# Altium project DAB_Template4Students.PrjPcb
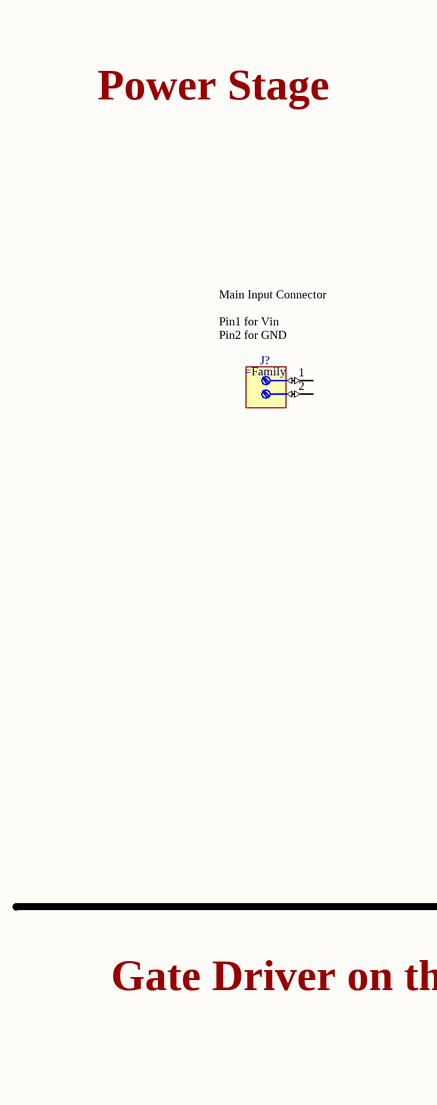
[diagram p0: DAB_Schematic.SchDoc, top left]
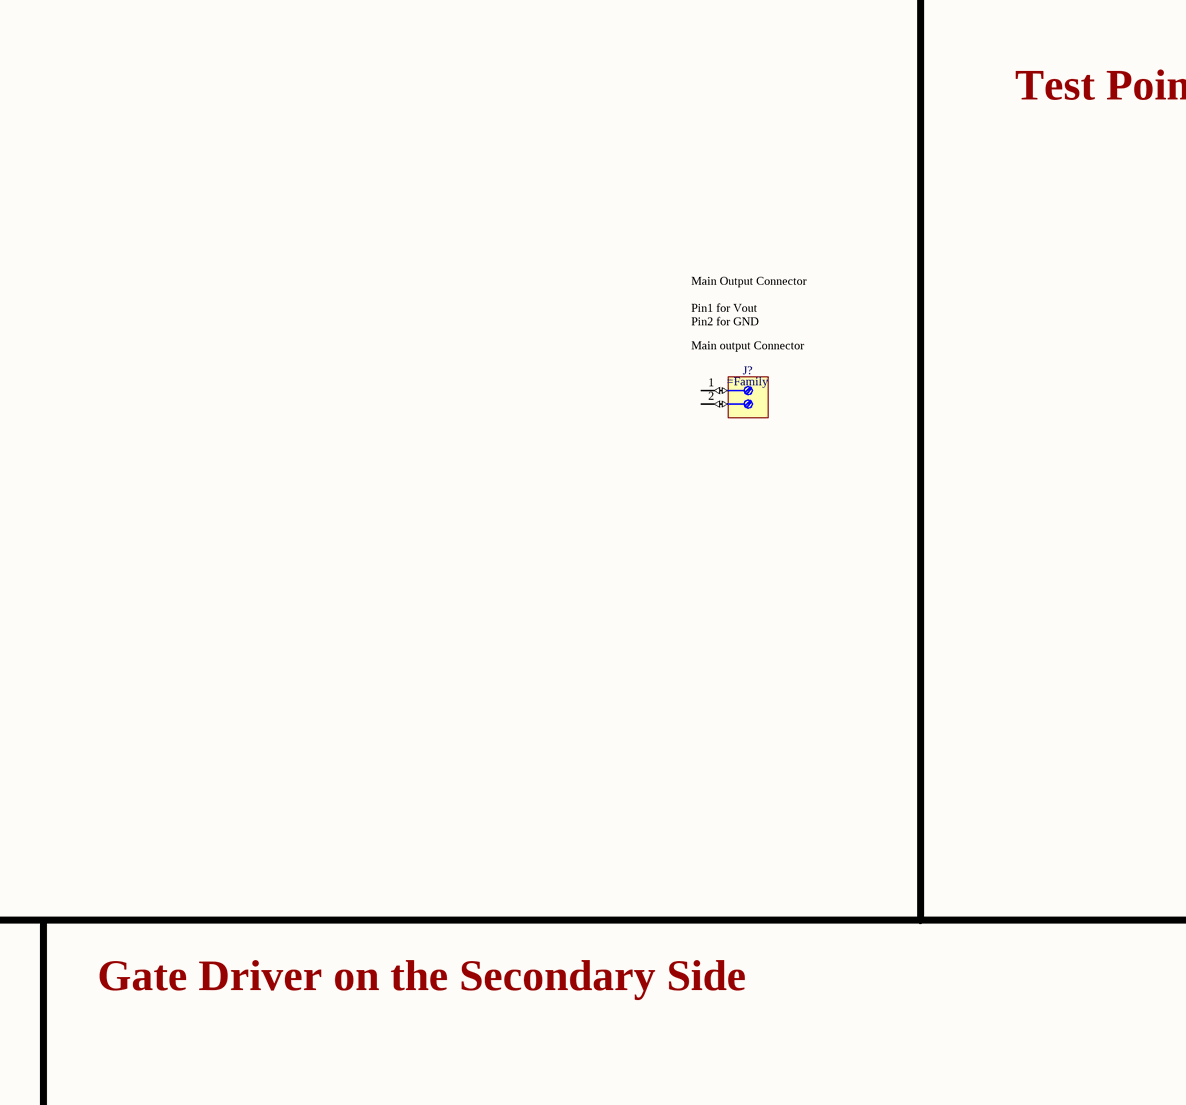
[diagram p1: DAB_Schematic.SchDoc, top middle]
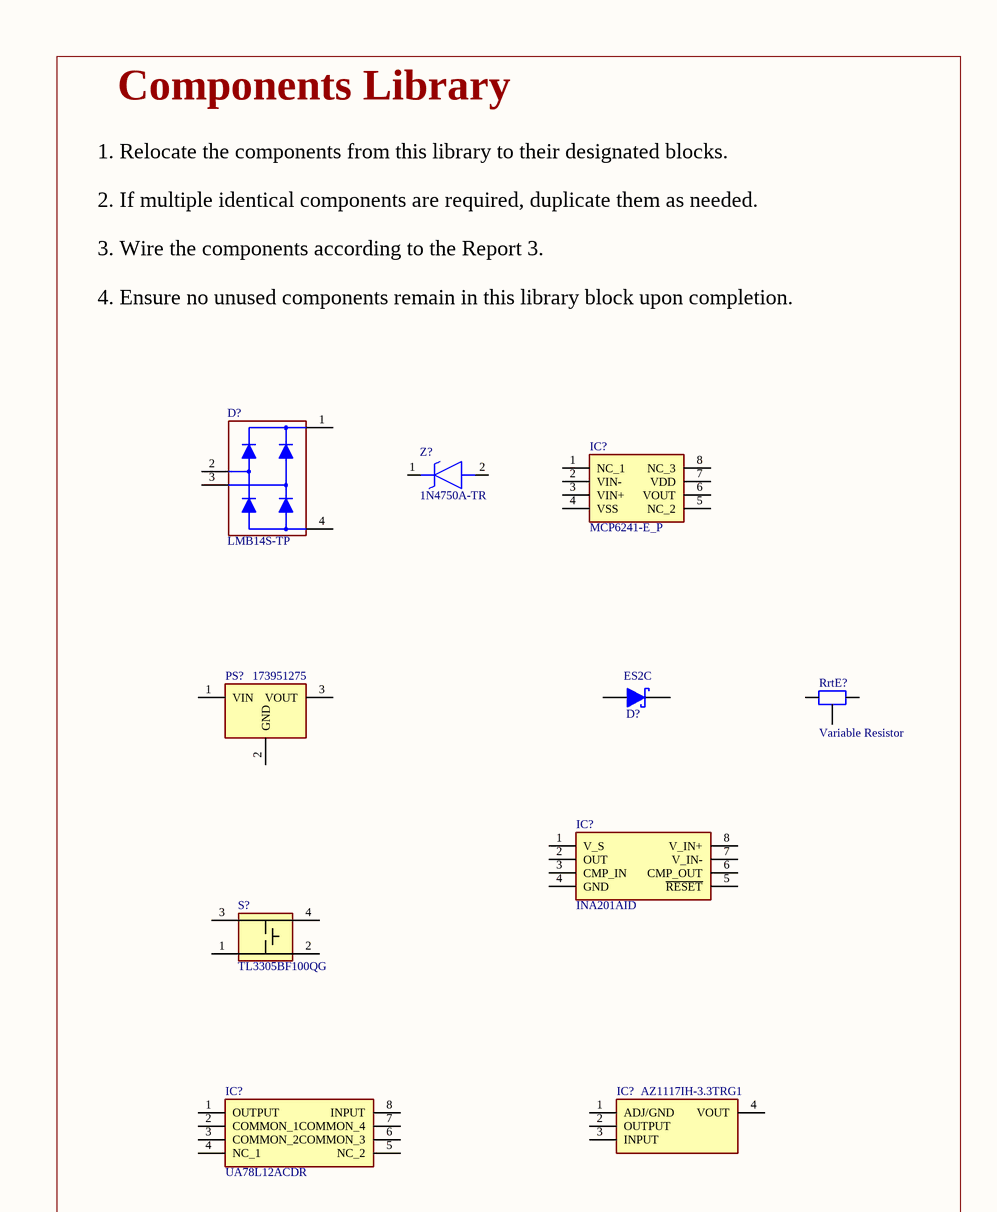
[diagram p2: DAB_Schematic.SchDoc, top right]
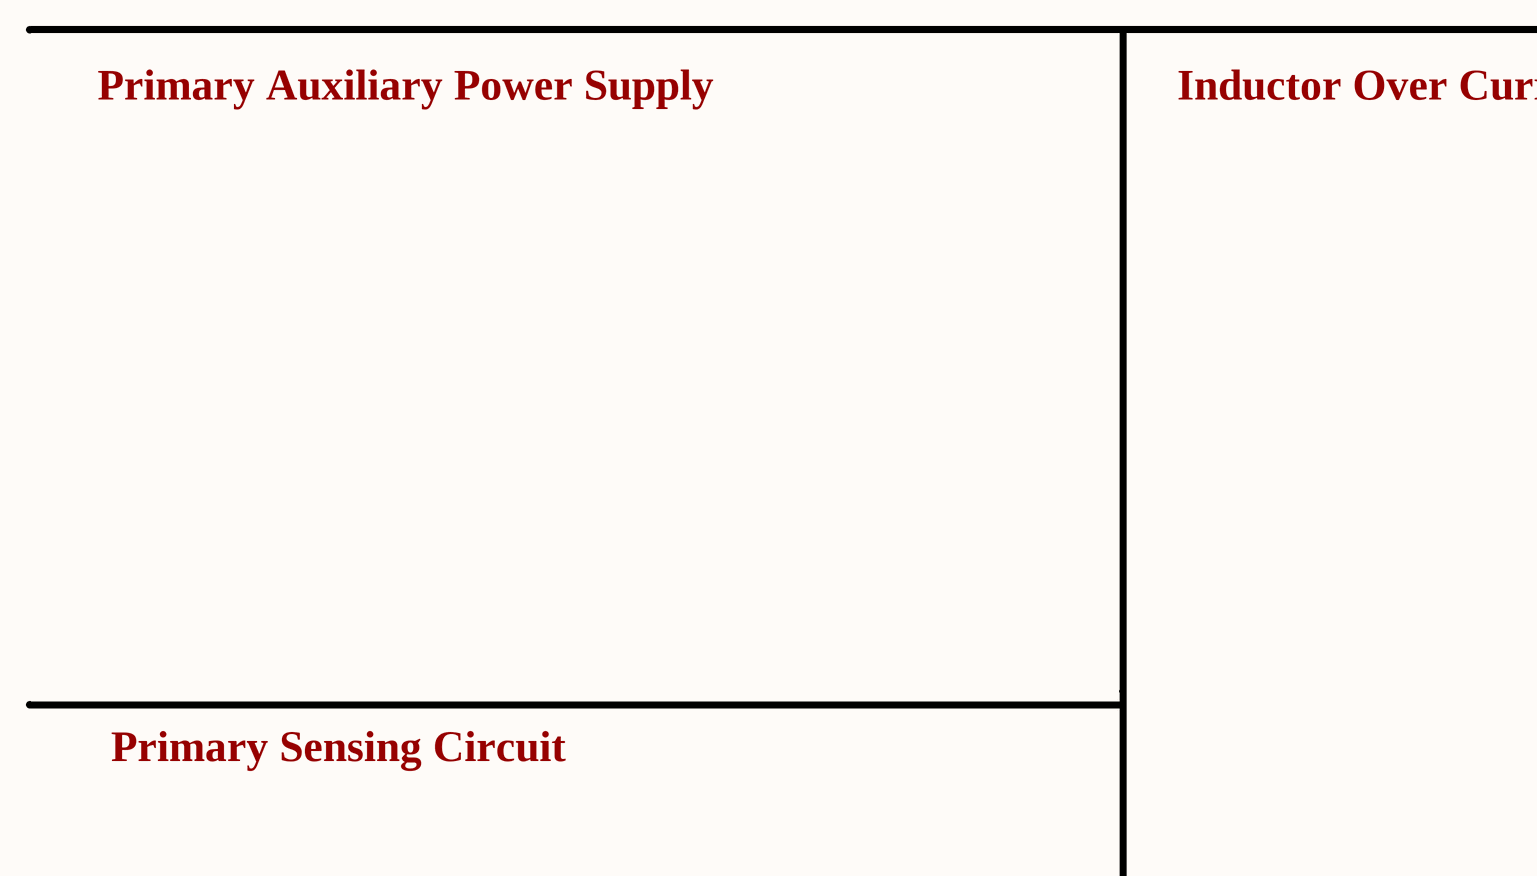
[diagram p3: DAB_Schematic.SchDoc, bottom left]
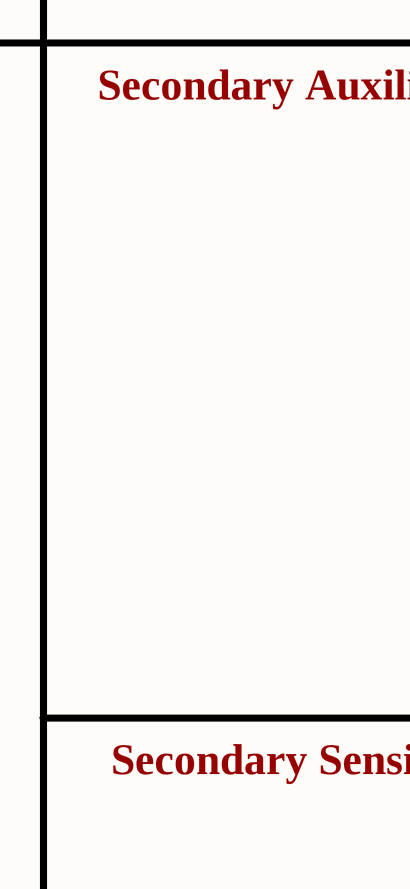
[diagram p4: DAB_Schematic.SchDoc, bottom middle]
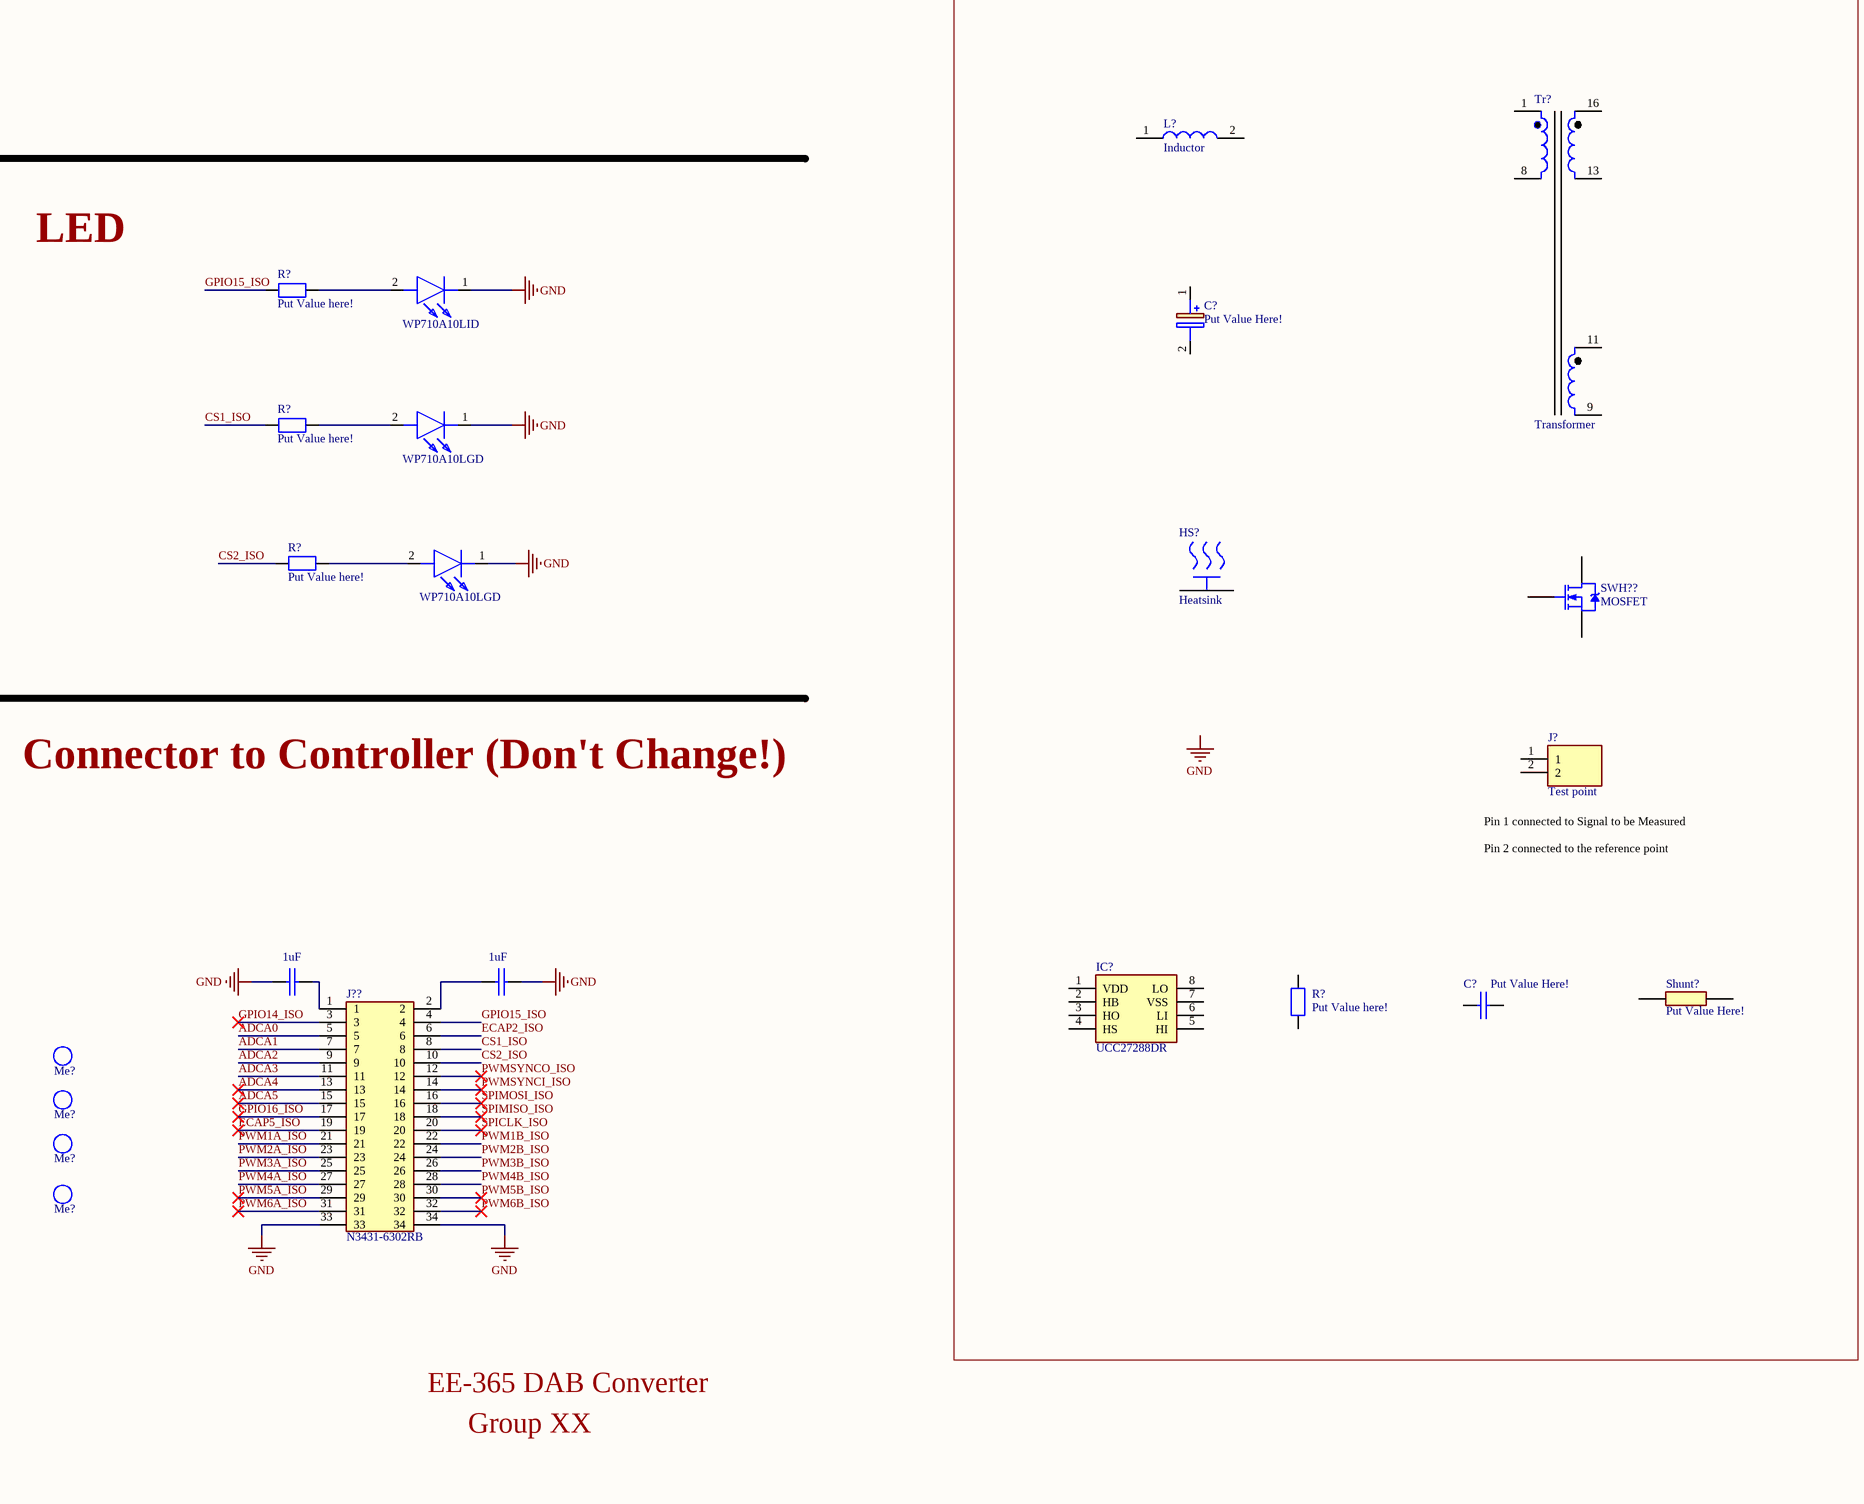
[diagram p5: DAB_Schematic.SchDoc, bottom right]
1 sheet, 35 parts. Net scope: global (net labels, ports and power ports of the same name join across sheets).
Board file: DAB_PCB.PcbDoc

## Sheet DAB_Schematic.SchDoc
size A1; SheetNumber: 1; SheetTotal: 1

### Parts
(Parts that share a designator on the sheet are numbered #1, #2 ... from top to bottom, then left to right.)
C?#1  Put Value Here!  [CAPPRD750W80D1625H3750]
C?#2  1uF  [SM/1206]
C?#3  1uF  [SM/1206]
C?#4  Put Value Here!  [SM/1206]
D?#1  LMB14S-TP  [LMB14STP]
D?#2  ES2C  [DIOM5436X244N]
HS?  Heatsink  [Heatsink FA-T220]
IC?#1  MCP6241-E_P  [DIP781W56P254L950H533Q8N]
IC?#2  INA201AID  [SOIC127P600X175-8N]
IC?#3  UA78L12ACDR  [SOIC127P600X175-8N]
IC?#4  AZ1117IH-3.3TRG1  [SOT230P700X180-4N]
IC?#5  UCC27288DR  [SOIC127P600X175-8N]
J?#1  (no value)  [PHOENIX  1755736]
J?#2  (no value)  [PHOENIX  1755736]
J?#3  Test point  [HDRV2W64P0X508_1X2_1016X254X838P]
J??  N3431-6302RB  [3M_N3431-6302RB]
L?  Inductor
LED?#1  WP710A10LID  [WP710A10LID]
LED?#2  WP710A10LGD  [WP710A10LGD]
LED?#3  WP710A10LGD  [WP710A10LGD]
Me?#1  M3-Hole  [M3]  (value not drawn)
Me?#2  M3-Hole  [M3]  (value not drawn)
Me?#3  M3-Hole  [M3]  (value not drawn)
Me?#4  M3-Hole  [M3]  (value not drawn)
PS?  173951275  [173951275]
R?#1  Put Value here!  [SM/1206]
R?#2  Put Value here!  [SM/1206]
R?#3  Put Value here!  [SM/1206]
R?#4  Put Value here!  [SM/1206]
RrtE?  Variable Resistor  [TRIMMER CT-6EP]
S?  TL3305BF100QG  [TL3305BF160QG]
Shunt?  Put Value Here!  [CSNL2512FT5L00]
SWH??  MOSFET  [TO-220AB]
Tr?  Transformer  [ETD39]
Z?  1N4750A-TR  [DIOAD1310W86L370D235]

### Blocks framed on the sheet
Components Library: C?#1 C?#4 D?#1 D?#2 HS? IC?#1-IC?#5 J?#3 L? PS? R?#4 RrtE? S? Shunt? SWH?? Tr? Z?

### Nets
GND: C?#2.1 C?#3.2 J??.33 J??.34 LED?#1.1(K) LED?#2.1(K) LED?#3.1(K)
ADCA0: J??.5
ADCA1: J??.7
ADCA2: J??.9
ADCA3: J??.11
ADCA4: J??.13
ADCA5: J??.15
CS1_ISO: J??.8 R?#2.2
CS2_ISO: J??.10 R?#3.2
ECAP2_ISO: J??.6
ECAP5_ISO: J??.19
GPIO14_ISO: J??.3
GPIO15_ISO: J??.4 R?#1.2
GPIO16_ISO: J??.17
PWM1A_ISO: J??.21
PWM1B_ISO: J??.22
PWM2A_ISO: J??.23
PWM2B_ISO: J??.24
PWM3A_ISO: J??.25
PWM3B_ISO: J??.26
PWM4A_ISO: J??.27
PWM4B_ISO: J??.28
PWM5A_ISO: J??.29
PWM5B_ISO: J??.30
PWM6A_ISO: J??.31
PWM6B_ISO: J??.32
PWMSYNCI_ISO: J??.14
PWMSYNCO_ISO: J??.12
SPICLK_ISO: J??.20
SPIMISO_ISO: J??.18
SPIMOSI_ISO: J??.16
NetC?#2_2: C?#2.2 J??.1
NetC?#3_1: C?#3.1 J??.2
NetLED?#1_2: LED?#1.2(A) R?#1.1
NetLED?#2_2: LED?#2.2(A) R?#2.1
NetLED?#3_2: LED?#3.2(A) R?#3.1

Not connected (* = marked no-connect by the designer): C?#1 1(+) 2(-); C?#4 1 2; D?#1 1(A) 2(AC_1) 3(AC_2) 4(K); D?#2 1(K) 2(A); HS? 1(MNT_1) 2; IC?#1 1(NC_1) 2(VIN-) 3(VIN+) 4(VSS) 5(NC_2) 6(VOUT) 7(VDD) 8(NC_3); IC?#2 1(V_S) 2(OUT) 3(CMP_IN) 4(GND) 5(~{RESET}) 6(CMP_OUT) 7(V_IN-) 8(V_IN+); IC?#3 1(OUTPUT) 2(COMMON_1) 3(COMMON_2) 4(NC_1) 5(NC_2) 6(COMMON_3) 7(COMMON_4) 8(INPUT); IC?#4 1(ADJ/GND) 2(OUTPUT) 3(INPUT) 4(VOUT); IC?#5 1(VDD) 2(HB) 3(HO) 4(HS) 5(HI) 6(LI) 7(VSS) 8(LO); J?#1 1 2; J?#2 1 2; J?#3 1 2; L? 1 2; PS? 1(VIN) 2(GND) 3(VOUT); R?#4 1 2; RrtE? 1 2 3; S? 1 2 3 4; Shunt? 1 2; SWH?? 1(G) 2(D) 3(S); Tr? 1 8 9 11 13 16; Z? 1(K) 2(A)

### Notes on the sheet
- Power Stage
- Test Points
- Main Output Connector
  Pin1 for Vout
  Pin2 for GND
- (near J?#1) Main Input Connector
  Pin1 for Vin
  Pin2 for GND
- (near J?#2) Main output Connector
- 1. Relocate the components from this library to their designated blocks.
  2. If multiple identical components are required, duplicate them as needed.
  3. Wire the components according to the Report 3.
  4. Ensure no unused components remain in this library block upon completion.
- Gate Driver on the Primary Side
- Gate Driver on the Secondary Side
- Primary Auxiliary Power Supply
- Inductor Over Current Detection Circuit
- Secondary Auxiliary Power Supply
- LED
- Connector to Controller (Don't Change!)
- (near J?#3) Pin 1 connected to Signal to be Measured
  Pin 2 connected to the reference point
- Primary Sensing Circuit
- Secondary Sensing Circuit
- EE-365 DAB Converter
- Group XX
- Labels drawn without touching a wire or pin: GND

### Library data of the parts
C?#1 = UHW2A681MHD: Capacitor; Manufacturer_Name: Nichicon; Datasheet Link: https://www.digikey.ph/en/products/detail/nichicon/UHW2A681MHD/5818028?msockid=39f1ec84d77b6f4428b7f904d6676eed; Height: 37.5mm; Manufacturer_Part_Number: UHW2A681MHD; Mouser Part Number: 647-UHW2A681MHD; Mouser Price/Stock: https://www.mouser.co.uk/ProductDetail/Nichicon/UHW2A681MHD/?qs=KdTYp8tcPgmYzat6Tz8y0A%3D%3D
C?#2-C?#4 = Capacitor (SMD): Capacitor (non polarized)
D?#1 = LMB14S-TP: full-bridge rectifier; Manufacturer_Name: MCC; Datasheet Link: https://www.mccsemi.com/pdf/Products/LMB12S-LMB110S(LMBS-1).pdf; Height: 1.71mm; Manufacturer_Part_Number: LMB14S-TP; Mouser Part Number: 833-LMB14S-TP; Mouser Price/Stock: https://www.mouser.co.uk/ProductDetail/Micro-Commercial-Components-MCC/LMB14S-TP?qs=P1JMDcb91o681gFxLNJ1UQ%3D%3D; Arrow Part Number: LMB14S-TP; Arrow Price/Stock: https://www.arrow.com/en/products/lmb14s-tp/micro-commercial-components
D?#2 = Schottky Diode
HS? = Heatsink: HEATSINK TO-218,TO-220,TO-247
IC?#1 = MCP6241-E_P: Integrated Circuit - Op Amp; Manufacturer_Name: Microchip; Manufacturer_Part_Number: MCP6241-E/P; Datasheet Link: http://ww1.microchip.com/downloads/en/DeviceDoc/21882d.pdf; Height: 5.334mm; Mouser Part Number: 579-MCP6241-E/P; Mouser Price/Stock: https://www.mouser.co.uk/ProductDetail/Microchip-Technology/MCP6241-E-P?qs=g6BBfX6YTkkJAE8LlpYY9A%3D%3D; Arrow Part Number: MCP6241-E/P; Arrow Price/Stock: https://www.arrow.com/en/products/mcp6241-ep/microchip-technology?utm_currency=USD&region=nac
IC?#2 = INA201AID: Integrated Circuit; Manufacturer_Name: Texas Instruments; Datasheet Link: http://www.ti.com/lit/gpn/INA201; Height: 1.75mm; Manufacturer_Part_Number: INA201AID; Mouser Part Number: 595-INA201AID; Mouser Price/Stock: https://www.mouser.co.uk/ProductDetail/Texas-Instruments/INA201AID?qs=wkx8pu8tL7JUWgtgkwU%252B9A%3D%3D; Arrow Part Number: INA201AID; Arrow Price/Stock: https://www.arrow.com/en/products/ina201aid/texas-instruments?utm_currency=USD&region=nac
IC?#3 = UA78L12ACDR: Integrated Circuit; Manufacturer_Name: Texas Instruments; Datasheet Link: http://www.ti.com/lit/gpn/ua78l; Height: 1.75mm; Manufacturer_Part_Number: UA78L12ACDR; Mouser Part Number: 595-UA78L12ACDR; Mouser Price/Stock: https://www.mouser.co.uk/ProductDetail/Texas-Instruments/UA78L12ACDR?qs=0O%2FZFlpUpJW5pw3BJ01ZLg%3D%3D; Arrow Part Number: UA78L12ACDR; Arrow Price/Stock: https://www.arrow.com/en/products/ua78l12acdr/texas-instruments?region=nac
IC?#4 = AZ1117IH-3.3TRG1: Integrated Circuit; Manufacturer_Name: Diodes Incorporated; Datasheet Link: https://www.diodes.com//assets/Datasheets/AZ1117I.pdf; Height: 1.8mm; Manufacturer_Part_Number: AZ1117IH-3.3TRG1; Mouser Part Number: 621-AZ1117IH-3.3TRG1; Mouser Price/Stock: https://www.mouser.co.uk/ProductDetail/Diodes-Incorporated/AZ1117IH-3.3TRG1?qs=cpo3%2FpBou2jnS4SxLgAVoA%3D%3D; Arrow Part Number: AZ1117IH-3.3TRG1; Arrow Price/Stock: https://www.arrow.com/en/products/az1117ih-3.3trg1/diodes-incorporated?utm_currency=USD&region=europe
IC?#5 = UCC27288DR: Integrated Circuit; Manufacturer_Name: Texas Instruments; Datasheet Link: https://www.arrow.com/en/products/ucc27288dr/texas-instruments; Height: 1.75mm; Manufacturer_Part_Number: UCC27288DR; Mouser Part Number: 595-UCC27288DR; Mouser Price/Stock: https://www.mouser.co.uk/ProductDetail/Texas-Instruments/UCC27288DR?qs=zW32dvEIR3s81MTqTT5v9Q%3D%3D; Arrow Part Number: UCC27288DR; Arrow Price/Stock: https://www.arrow.com/en/products/ucc27288dr/texas-instruments?utm_currency=USD&region=europe
J?#1 J?#2 = Phoenix-1755736: Connector 2 pos
J?#3 = Test point: Manufacturer_Name: SAMTEC; Manufacturer_Part_Number: TSW-202-07-T-S; Datasheet Link: http://suddendocs.samtec.com/catalog_english/tsw_th.pdf; Height: 8.38mm; Mouser Part Number: 200-TSW20207TS; Mouser Price/Stock: https://www.mouser.co.uk/ProductDetail/Samtec/TSW-202-07-T-S?qs=rU5fayqh%252BE1T8HlkVOHZPg%3D%3D; Arrow Part Number: TSW-202-07-T-S; Arrow Price/Stock: https://www.arrow.com/en/products/tsw-202-07-t-s/samtec?utm_currency=USD&region=europe
J?? = N3431-6302RB: Connector; Manufacturer_Name: Hirose; Manufacturer_Part_Number: HIF3FC-34PA-2.54DS(71); Datasheet Link: http://uk.rs-online.com/web/p/products/8961111; Height: 8.5mm; Mouser Part Number: 798-HIF3FC34PA254DS1; Mouser Price/Stock: https://www.mouser.co.uk/ProductDetail/Hirose-Connector/HIF3FC-34PA-2.54DS71?qs=eDUdFcBPps12jUkdM6VM2w%3D%3D
L? = Inductor: Manufacturer_Name: TDK; Manufacturer_Part_Number: MLZ2012N100LT000; Datasheet Link: https://product.tdk.com/system/files/dam/doc/product/inductor/inductor/smd/catalog/inductor_commercial_decoupling_mlz2012_en.pdf; Height: 1.05mm; Mouser Part Number: 810-MLZ2012N100LT000; Mouser Price/Stock: https://www.mouser.co.uk/ProductDetail/TDK/MLZ2012N100LT000?qs=%2FPzWLGNeQ%252BhBF9df2MjAZQ%3D%3D; Arrow Part Number: MLZ2012N100LT000; Arrow Price/Stock: https://www.arrow.com/en/products/mlz2012n100lt000/tdk?region=nac; ComponentLink1Description: Mouser; ComponentLink1URL: https://www.mouser.ch/ProductDetail/TDK/MLZ2012N100LT000?qs=%2FPzWLGNeQ%252BhBF9df2MjAZQ%3D%3D
LED?#1 = WP710A10LID: LED Red; Manufacturer_Name: Kingbright; Datasheet Link: https://www.kingbrightusa.com/images/catalog/SPEC/WP710A10LID.pdf; Height: 5.9mm; Manufacturer_Part_Number: WP710A10LID; Mouser Part Number: 604-WP710A10LID; Mouser Price/Stock: https://www.mouser.co.uk/ProductDetail/Kingbright/WP710A10LID?qs=jBF9H7RTBaSn1LemoiEgcA%3D%3D; Arrow Part Number: WP710A10LID; Arrow Price/Stock: https://www.arrow.com/en/products/wp710a10lid/kingbright?utm_currency=USD&region=nac
LED?#2 LED?#3 = WP710A10LGD: LED Green; Manufacturer_Name: Kingbright; Datasheet Link: https://www.kingbrightusa.com/images/catalog/SPEC/WP710A10LGD.pdf; Height: 5.9mm; Manufacturer_Part_Number: WP710A10LGD; Mouser Part Number: 604-WP710A10LGD; Mouser Price/Stock: https://www.mouser.com/Search/Refine.aspx?Keyword=604-WP710A10LGD; Arrow Part Number: WP710A10LGD; Arrow Price/Stock: https://www.arrow.com/en/products/wp710a10lgd/kingbright?region=nac
Me?#1-Me?#4 = M3-Hole: M3 Mounting Holes.
PS? = 173951275: Power Supply; Manufacturer_Name: Wurth Elektronik; Datasheet Link: https://www.we-online.com/components/products/datasheet/173951275.pdf; Height: 18mm; Manufacturer_Part_Number: 173951275
R?#1-R?#4 = Resistor (SMD): Resistor (Surface Mounted)
S? = TL3305BF100QG: Push Button; Manufacturer_Name: E-Switch; Datasheet Link: https://configured-product-images.s3.amazonaws.com/2D/specs/TL3305BF100QG.pdf; Manufacturer_Part_Number: TL3305BF100QG; Mouser Part Number: 612-TL3305BF100QG; Mouser Price/Stock: https://www.mouser.co.uk/ProductDetail/E-Switch/TL3305BF100QG?qs=IKkN%2F947nfDIPwqPQja%252BvQ%3D%3D
Shunt? = ShuntResistor: Shunt Resistor; Manufacturer_Name: Stackpole Electronics; Datasheet Link: https://cs.seielect.com/catalog/SEI-CSNL.pdf; Height: 0.55mm; Manufacturer_Part_Number: CSNL2512FT5L00; Arrow Part Number: CSNL2512FT5L00; Arrow Price/Stock: https://www.arrow.com/en/products/csnl2512ft5l00/stackpole-electronics
SWH?? = NMOS-2: N-Channel Power MOSFET
Tr? = Transformer: Manufacturer_Name: TDK; Manufacturer_Part_Number: MLZ2012N100LT000; Datasheet Link: https://product.tdk.com/system/files/dam/doc/product/inductor/inductor/smd/catalog/inductor_commercial_decoupling_mlz2012_en.pdf; Height: 1.05mm; Mouser Part Number: 810-MLZ2012N100LT000; Mouser Price/Stock: https://www.mouser.co.uk/ProductDetail/TDK/MLZ2012N100LT000?qs=%2FPzWLGNeQ%252BhBF9df2MjAZQ%3D%3D; Arrow Part Number: MLZ2012N100LT000; Arrow Price/Stock: https://www.arrow.com/en/products/mlz2012n100lt000/tdk?region=nac; ComponentLink1Description: Mouser; ComponentLink1URL: https://www.mouser.ch/ProductDetail/TDK/MLZ2012N100LT000?qs=%2FPzWLGNeQ%252BhBF9df2MjAZQ%3D%3D
Z? = 1N4750A-TR: Zener Diode; Manufacturer_Name: Vishay; Datasheet Link: http://www.vishay.com/docs/85816/1n4728a.pdf; Manufacturer_Part_Number: 1N4750A-TR; Mouser Part Number: 78-1N4750A; Mouser Price/Stock: https://www.mouser.co.uk/ProductDetail/Vishay-Semiconductors/1N4750A-TR?qs=TNTIDjy6APqxkqc3HzV0eA%3D%3D; Arrow Part Number: 1N4750A-TR; Arrow Price/Stock: https://www.arrow.com/en/products/1n4750a-tr/vishay?region=nac